# Altium schematic sheet UC.SchDoc
size B
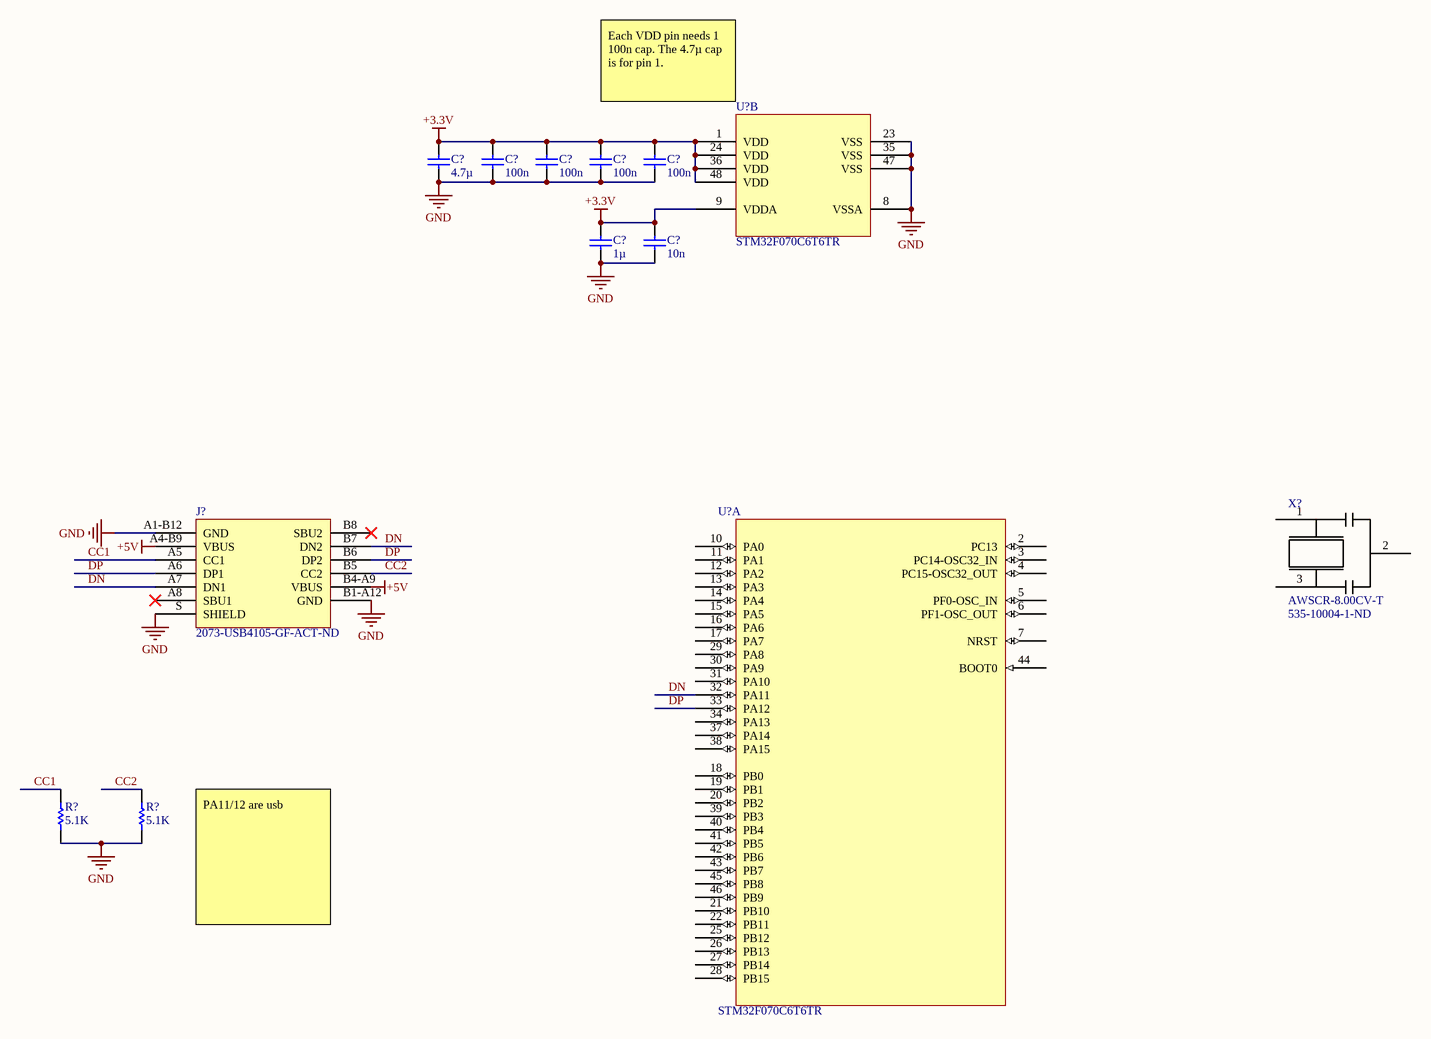
[diagram p0: UC.SchDoc]

## Parts
(Parts that share a designator on the sheet are numbered #1, #2 ... from top to bottom, then left to right.)
C?#1  value 4.7µ  (hidden comment: Capacitor)
C?#2  value 100n  (hidden comment: Capacitor)
C?#3  value 100n  (hidden comment: Capacitor)
C?#4  value 100n  (hidden comment: Capacitor)
C?#5  value 100n  (hidden comment: Capacitor)
C?#6  value 1µ  (hidden comment: Capacitor)
C?#7  value 10n  (hidden comment: Capacitor)
J?  Supplier Part Number: 2073-USB4105-GF-ACT-ND  [USB4105_GCT]  (hidden comment: USB4105-GF-A)
R?#1  value 5.1K  (hidden comment: Resistor)
R?#2  value 5.1K  (hidden comment: Resistor)
U?#1  STM32F070C6T6TR  [LQFP48-7x7mm]  (part B of 2)
U?#2  STM32F070C6T6TR  [LQFP48-7x7mm]  (part A of 2)
X?  AWSCR-8.00CV-T  Supplier Part Number 1: 535-10004-1-ND

## Nets
+3.3V: C?#1.1 C?#2.1 C?#3.1 C?#4.1 C?#5.1 C?#6.2 C?#7.2 U?#1.1(VDD) U?#1.9(VDDA) U?#1.24(VDD) U?#1.36(VDD) U?#1.48(VDD)
+5V: J?.A4-B9(VBUS) J?.B4-A9(VBUS)
GND: C?#1.2 C?#2.2 C?#3.2 C?#4.2 C?#5.2 C?#6.1 C?#7.1 J?.A1-B12(GND) J?.B1-A12(GND) J?.S(SHIELD) R?#1.1 R?#2.1 U?#1.8(VSSA) U?#1.23(VSS) U?#1.35(VSS) U?#1.47(VSS)
CC1: J?.A5(CC1) R?#1.2
CC2: J?.B5(CC2) R?#2.2
DN: J?.A7(DN1) J?.B7(DN2) U?#2.32(PA11)
DP: J?.A6(DP1) J?.B6(DP2) U?#2.33(PA12)

Not connected (* = marked no-connect by the designer): J? A8(SBU1)* B8(SBU2)*; U?#2 2(PC13) 3(PC14-OSC32_IN) 4(PC15-OSC32_OUT) 5(PF0-OSC_IN) 6(PF1-OSC_OUT) 7(NRST) 10(PA0) 11(PA1) 12(PA2) 13(PA3) 14(PA4) 15(PA5) 16(PA6) 17(PA7) 18(PB0) 19(PB1) 20(PB2) 21(PB10) 22(PB11) 25(PB12) 26(PB13) 27(PB14) 28(PB15) 29(PA8) 30(PA9) 31(PA10) 34(PA13) 37(PA14) 38(PA15) 39(PB3) 40(PB4) 41(PB5) 42(PB6) 43(PB7) 44(BOOT0) 45(PB8) 46(PB9); X? 1(IN) 2(GND) 3(OUT)

## Notes on the sheet
- Each VDD pin needs 1 100n cap. The 4.7µ cap is for pin 1.
- PA11/12 are usb

## Library data of the parts
C?#1-C?#7 = Capacitor: SimulationGenericComponent: True
J? = CONN (GT, USB4105-GF-A): Conn USB 2.0 Type C RCP 24 POS 0.3mm/0.5mm Solder RA SMD 24 Terminal 1 Port T/R; Manufacturer: Global Connector Technology; Gender: Receptacle; Mating Cycles: 10000; Shielding: Shielded; Number of Ports: 1; Supplier: Digikey; Manufacturer Part Number: USB4105-GF-A; RoHS: Yes; Category: USB Connectors; Stock: 2137; Pricing: 1=0.75400, 10=0.68200, 25=0.64000, 50=0.61200, 100=0.58400, 250=0.52900, 500=0.48700 (USD); Mounting Technology: Surface Mount,Through Hole,Horizontal; Contact Plating: Gold; Insulation Color: Black; Min Operating Temperature: -40°C; Max Operating Temperature: 85°C; Connector Type: USB; Series: USB4105; Termination: Solder; Flammability Rating: UL94 V-0; ComponentLink1URL: https://gct.co/files/drawings/usb4105.pdf?src-supplier=Digi-Key; ComponentLink1Description: https://gct.co/files/drawings/usb4105.pdf?src-supplier=Digi-Key
R?#1 R?#2 = Resistor: TC1: 0; SimulationGenericComponent: True; TC2: 0
U?#1 U?#2 = UCONTROLLER (STM, STM32F070C6T6TR): No Description Available; Mfr_Name: STMicroelectronics; Copyright: Copyright (C) 2022 Ultra Librarian. All rights reserved.; Manufacturer_Part_Number: STM32F070C6T6TR; RefDes: RefDes; Type: DEV; Supplier 1: Digi-Key; Supplier Part Number 1: 497-17352-ND
X? = RESONATOR,8MHZ,AWSCR-8.00CV-T: Ceramic Resonator 8MHz ±0.5% (Tol) ±0.4% (Stability) 22pF 30Ohm 3-Pin CSMD T/R; Manufacturer: Abracon; Impedance: 30R; Supplier: Digi-Key; Supplier Part Number: 535-10004-1-ND; Manufacturer Part Number: AWSCR-8.00CV-T; RoHS: Yes; Category: Resonators; Stock: 69584; Pricing: 1=0.42000, 10=0.34800, 50=0.31320, 100=0.27840, 500=0.26444 (USD); Mounting Technology: Surface Mount; Case/Package: SMD/SMT; Pins: 3; Min Operating Temperature: -25°C; Max Operating Temperature: 85°C; Frequency: 8MHz; Package Quantity: 1000; Frequency Tolerance: 0.5%; Value: 22pF; Packaging: Tape and Reel; Load Capacitance: 22pF; Tolerance: 0.5%; Resistor Type: Ceramic; Termination: SMD/SMT; Frequency Stability: 0.4%; Self Resonant Frequency: 8MHz; Series: AWSCR-CV; Operating Frequency: 8 MHz; Length: 0.146inch; Width: 0.122inch; Height: 0.039inch; Lead Free: Lead Free; ComponentLink1URL: https://datasheet.ciiva.com/884/awscr-cv-884663.pdf?src-supplier=Digi-Key; ComponentLink1Description: https://datasheet.ciiva.com/884/awscr-cv-884663.pdf?src-supplier=Digi-Key; ComponentLink2URL: https://datasheet.ciiva.com/884/awscr-cv-884664.pdf?src-supplier=Digi-Key; ComponentLink2Description: https://datasheet.ciiva.com/884/awscr-cv-884664.pdf?src-supplier=Digi-Key; ComponentLink3URL: https://datasheet.ciiva.com/884/awscr-cv-884665.pdf?src-supplier=Digi-Key; ComponentLink3Description: https://datasheet.ciiva.com/884/awscr-cv-884665.pdf?src-supplier=Digi-Key; ComponentLink4URL: https://datasheet.ciiva.com/4951/awscr-cv-4951066.pdf?src-supplier=Mouser; ComponentLink4Description: https://datasheet.ciiva.com/4951/awscr-cv-4951066.pdf?src-supplier=Mouser; ComponentLink5URL: https://datasheet.ciiva.com/16413/awscr-cv-16413614.pdf?src-supplier=Future+Electronics; ComponentLink5Description: https://datasheet.ciiva.com/16413/awscr-cv-16413614.pdf?src-supplier=Future+Electronics; ComponentLink6URL: https://datasheet.ciiva.com/1393/awscr-cv-1393160.pdf?src-supplier=Newark; ComponentLink6Description: https://datasheet.ciiva.com/1393/awscr-cv-1393160.pdf?src-supplier=Newark; Supplier 1: Digi-Key